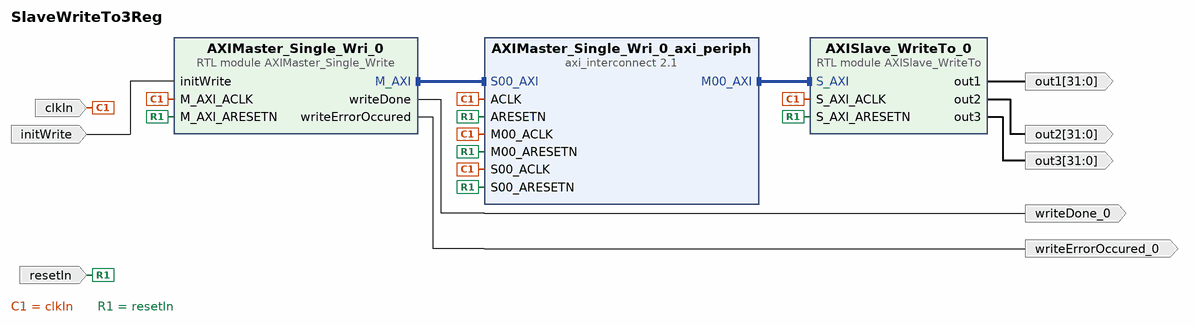
[diagram p0: block diagram of the top level]
# Vivado block design SlaveWriteTo3Reg, xc7z010clg400-1, Vivado 2019.1
create_bd_design SlaveWriteTo3Reg

create_bd_port -dir I initWrite
create_bd_port -dir O -from 31 -to 0 out1
create_bd_port -dir O -from 31 -to 0 out2
create_bd_port -dir O -from 31 -to 0 out3
create_bd_port -dir I clkIn
create_bd_port -dir I resetIn
create_bd_port -dir O writeDone_0
create_bd_port -dir O writeErrorOccured_0

create_bd_cell -type module -reference AXISlave_WriteTo AXISlave_WriteTo_0
create_bd_cell -type module -reference AXIMaster_Single_Write AXIMaster_Single_Wri_0
create_bd_cell -type ip -vlnv xilinx.com:ip:axi_interconnect:2.1 AXIMaster_Single_Wri_0_axi_periph
set_property -dict {CONFIG.NUM_MI 1} [get_bd_cells AXIMaster_Single_Wri_0_axi_periph]

# ---- connections ----

connect_bd_intf_net [get_bd_intf_pins AXIMaster_Single_Wri_0/M_AXI] [get_bd_intf_pins AXIMaster_Single_Wri_0_axi_periph/S00_AXI]
connect_bd_intf_net [get_bd_intf_pins AXIMaster_Single_Wri_0_axi_periph/M00_AXI] [get_bd_intf_pins AXISlave_WriteTo_0/S_AXI]
connect_bd_net -net clk_wiz_clk_out1 [get_bd_ports clkIn] \
  [get_bd_pins AXIMaster_Single_Wri_0/M_AXI_ACLK] [get_bd_pins AXIMaster_Single_Wri_0_axi_periph/S00_ACLK] \
  [get_bd_pins AXISlave_WriteTo_0/S_AXI_ACLK] [get_bd_pins AXIMaster_Single_Wri_0_axi_periph/M00_ACLK] \
  [get_bd_pins AXIMaster_Single_Wri_0_axi_periph/ACLK]
connect_bd_net -net rst_clk_wiz_100M_peripheral_aresetn [get_bd_ports resetIn] \
  [get_bd_pins AXIMaster_Single_Wri_0/M_AXI_ARESETN] [get_bd_pins AXIMaster_Single_Wri_0_axi_periph/S00_ARESETN] \
  [get_bd_pins AXISlave_WriteTo_0/S_AXI_ARESETN] [get_bd_pins AXIMaster_Single_Wri_0_axi_periph/M00_ARESETN] \
  [get_bd_pins AXIMaster_Single_Wri_0_axi_periph/ARESETN]
connect_bd_net [get_bd_ports initWrite] [get_bd_pins AXIMaster_Single_Wri_0/initWrite]
connect_bd_net [get_bd_pins AXISlave_WriteTo_0/out1] [get_bd_ports out1]
connect_bd_net [get_bd_pins AXISlave_WriteTo_0/out2] [get_bd_ports out2]
connect_bd_net [get_bd_pins AXISlave_WriteTo_0/out3] [get_bd_ports out3]
connect_bd_net [get_bd_pins AXIMaster_Single_Wri_0/writeDone] [get_bd_ports writeDone_0]
connect_bd_net [get_bd_pins AXIMaster_Single_Wri_0/writeErrorOccured] [get_bd_ports writeErrorOccured_0]

# ---- address map ----
assign_bd_address -offset 0x00000000 -range 4G -target_address_space [get_bd_addr_spaces AXIMaster_Single_Wri_0/M_AXI] [get_bd_addr_segs AXISlave_WriteTo_0/S_AXI/reg0]

validate_bd_design
save_bd_design
